# Altium schematic sheet supply.SchDoc: Local Supply
size A3; CheckedBy: (not checked); Author: P. Kuligowski
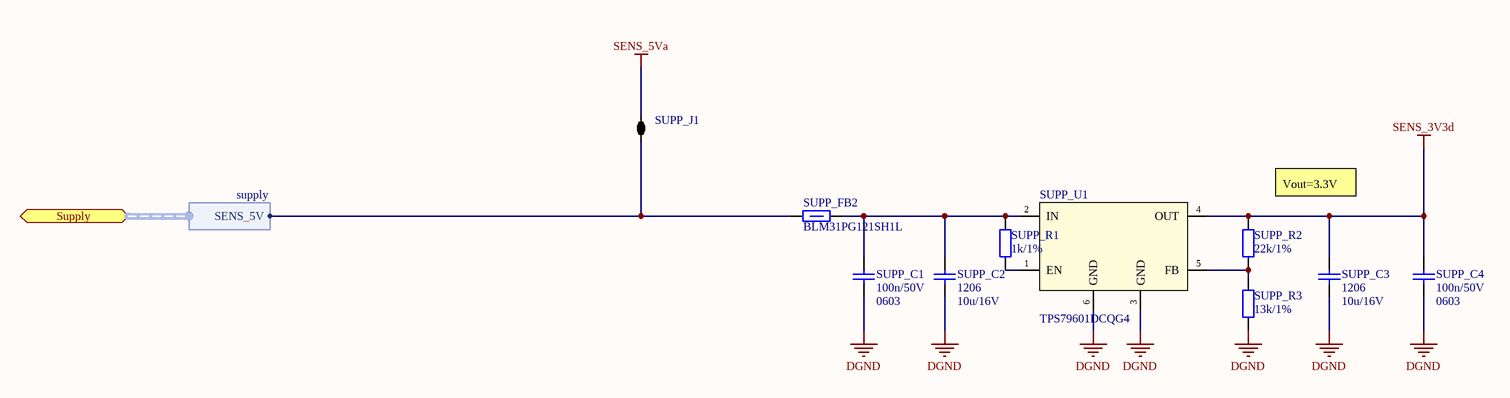
[diagram p0: supply.SchDoc]

## Parts
SUPP_C1  Package: 0603  [SMD_Capacitor_0603]  (hidden comment: 100n/50V)
SUPP_C2  Packge: 1206  [SMD_Capacitor_1206]  (hidden comment: 10u/16V)
SUPP_C3  Packge: 1206  [SMD_Capacitor_1206]  (hidden comment: 10u/16V)
SUPP_C4  Package: 0603  [SMD_Capacitor_0603]  (hidden comment: 100n/50V)
SUPP_FB2  120R/100MHz  [SMD_FerriteBead_1206]  (value not drawn)
SUPP_J1  2 way net tie junction  [2way_LP]  (value not drawn)  (net tie, no BOM)
SUPP_R1  1k/1%  [SMD_Resistor_0603]
SUPP_R2  22k/1%  [SMD_Resistor_0603]
SUPP_R3  13k/1%  [SMD_Resistor_0603]
SUPP_U1  (no value)  [TI-DCQ]

## Ports
Supply (harness supply)

## Harnesses
supply: SENS_5V

## Nets
DGND: SUPP_C1.2 SUPP_C2.2 SUPP_C3.2 SUPP_C4.2 SUPP_R3.2 SUPP_U1.3(GND) SUPP_U1.6(GND)
SENS_3V3d: SUPP_C3.1 SUPP_C4.1 SUPP_R2.1 SUPP_U1.4(OUT)
SENS_5Va: SUPP_J1.2
NetSUPP_C1_1: SUPP_C1.1 SUPP_C2.1 SUPP_FB2.2 SUPP_R1.1 SUPP_U1.2(IN)
NetSUPP_FB2_1: SUPP_FB2.1 SUPP_J1.1 ; port Supply.SENS_5V
NetSUPP_R1_2: SUPP_R1.2 SUPP_U1.1(EN)
NetSUPP_R2_2: SUPP_R2.2 SUPP_R3.1 SUPP_U1.5(FB)

## Notes on the sheet
- (near SUPP_R2) Vout=3.3V
- Title:
- Project:
- Author:
- Model:
- Document Number:
- Checked by:
- Rev:
- Date:
- Approved by:
- Sheet:
- of
- File name:

## Library data of the parts
SUPP_C1 SUPP_C4 = Cer_C0603T104K5RALTU: Ceramic Cap Kemet COTS 100n/50V X7R 0603; Manufacturer: Kemet; ManufacturerPartNumber: C0603T104K5RALTU; Value: 100n/50V
SUPP_C2 SUPP_C3 = Cer_C1206T106K4RACTU: Ceramic Cap Kemet COTS 10u/16V X7R 1206; ManufacturerPartNumber: C1206T106K4RACTU; Manufacturer: Kemet; Value: 10u/16V
SUPP_FB2 = BLM31PG121SH1L: Ferrite bead, 1206, 0.02HM, 3.5A.; Manufacturer: Murata; Current Rating: 3.5A; Series Resistance DC: 0.02R; Package: 1206; Value: 120R/100MHz; ManufacturerPartNumber: BLM31PG121SH1L
SUPP_J1 = 2way: ComponentLink1URL: http://www.edatools.cz/addons; ComponentLink1Description: Source; FootprintNote: LP=12mil, MP=40mil, HP=120mil
SUPP_R1 = CRCW06031K00FKxxxx: 1k/1% Vishay CRCW 0603 Resistor. 100mW, 100ppm, 75V.; Manufacturer: Vishay; ManufacturerPartNumber: CRCW06031K00FKxxxx; Value: 1k/1%; Package: 0603
SUPP_R2 SUPP_R3 = Res: Package: 0603
  SUPP_R2: Value: 22k/1%
  SUPP_R3: Value: 13k/1%
SUPP_U1 = TPS79601DCQG4: 1A, Ajdustable LDO, Ultralow-Noise, High PSRR, Fast, RF; Manufacturer: Texas Instruments; ManufacturerPartNumber: TPS79601DCQG4; HelpUrl: http://www.ti.com/lit/ds/slvs351p/slvs351p.pdf